# Altium project EmitterPCB.PrjPcb
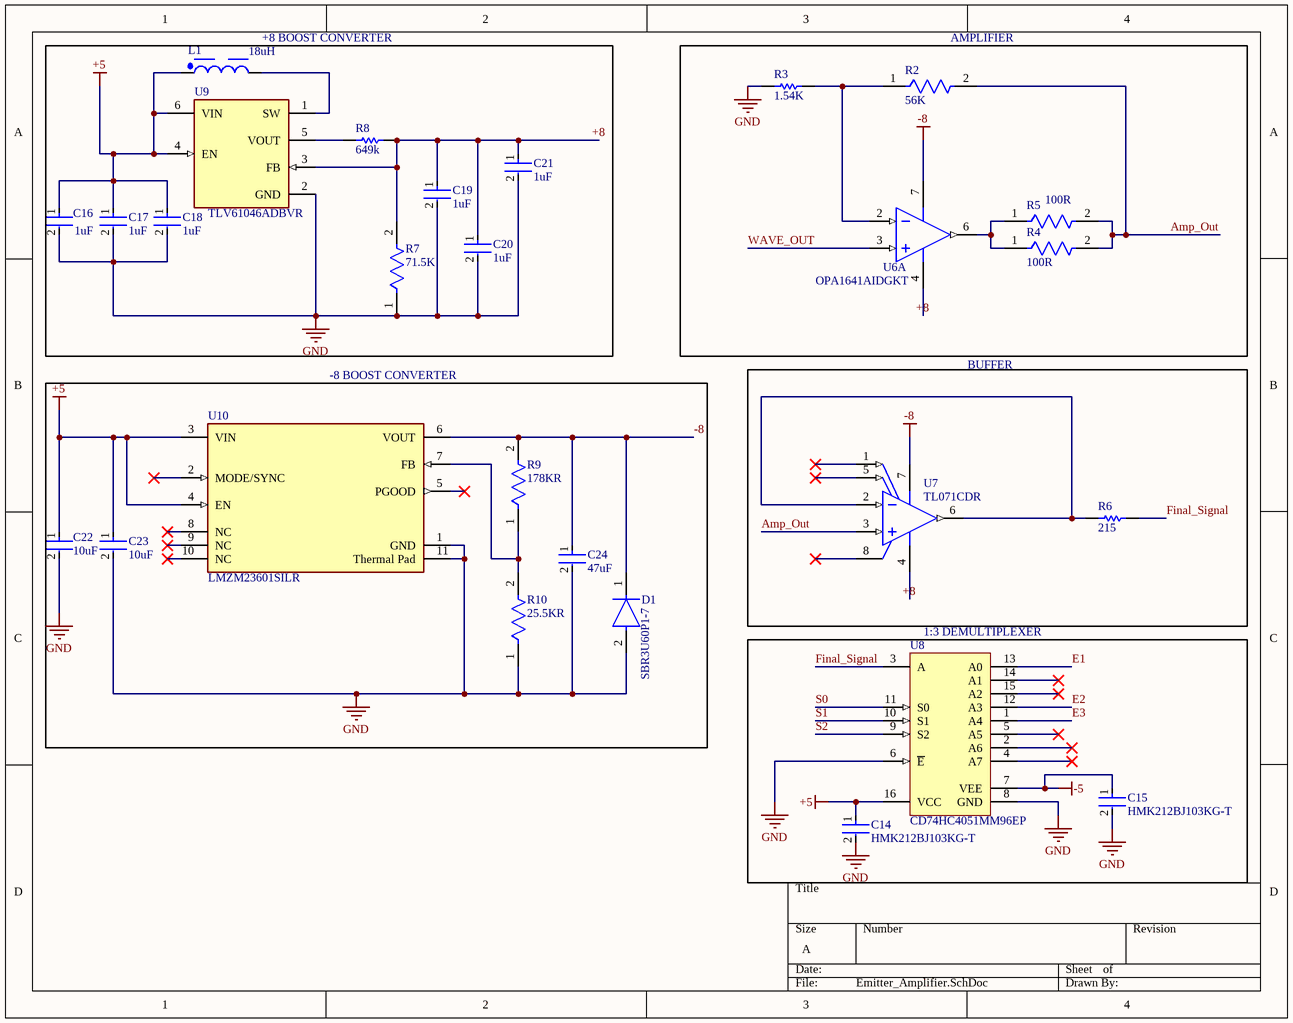
[diagram p0: Emitter_Amplifier.SchDoc]
2 sheets, 34 parts. Net scope: global (net labels, ports and power ports of the same name join across sheets).
Board file: EmitterPCB.PcbDoc
Sheets:
  Emitter_Amplifier.SchDoc
  -5BuckConverter.SchDoc

## Sheet Emitter_Amplifier.SchDoc
size A; SheetNumber: 2; SheetTotal: 3

### Parts
C14  HMK212BJ103KG-T  [FP-0805-L_2_0_0_1-W_1_25-IPC_B]
C15  HMK212BJ103KG-T  [FP-0805-L_2_0_0_1-W_1_25-IPC_B]
C16  1uF  [FP-0603-L_1_6_0_1-W_0_8_0-IPC_C]
C17  1uF  [FP-0603-L_1_6_0_1-W_0_8_0-IPC_C]
C18  1uF  [FP-0603-L_1_6_0_1-W_0_8_0-IPC_C]
C19  1uF  [FP-0603-L_1_6_0_1-W_0_8_0-IPC_C]
C20  1uF  [FP-0603-L_1_6_0_1-W_0_8_0-IPC_C]
C21  1uF  [FP-0603-L_1_6_0_1-W_0_8_0-IPC_C]
C22  10uF  [FP-GRM21B-0_15-IPC_A]
C23  10uF  [FP-0805-L_2_0_0_2-W_1_25-IPC_A]
C24  47uF  [FP-GRM32E-0_3-0_2-IPC_C]
D1  SBR3U60P1-7  [FP-PowerDI123-MFG]
L1  18uH  [WE-PD2_5848]
R2  56K  [FP-MCR10-IPC_C]
R3  1.54K  [RESC2013X70X40LL20T20]
R4  100R  [FP-ERJ6EN-MFG]
R5  100R  [FP-ERJ6EN-MFG]
R6  215  [RESC2013X70X40NL20T20]
R7  71.5K  [FP-RG2012-MFG]
R8  649k  [RESC2013X70X40ML20T20]
R9  178KR  [FP-CR0805-IPC_C]
R10  25.5KR  [FP-CRCW0805-e3-IPC_A]
U6  OPA1641AIDGKT  [DGK0008A_N]  (part A of 2)
U7  TL071CDR  [D0008A_M]
U8  CD74HC4051MM96EP  [D0016A_L]
U9  TLV61046ADBVR  [FP-DBV0006A-MFG]
U10  LMZM23601SILR  [FP-SIL0010A-MFG]

### Blocks framed on the sheet
+8 BOOST CONVERTER: C16-C21 L1 R7 R8 U9
AMPLIFIER: R2-R5 U6
-8 BOOST CONVERTER: C22-C24 D1 R9 R10 U10
BUFFER: R6 U7
1:3 DEMULTIPLEXER: C14 C15 U8

### Nets
+5: C14.1 C16.1 C17.1 C18.1 C22.1 C23.1 L1.1 U8.16(VCC) U9.4(EN) U9.6(VIN) U10.3(VIN) U10.4(EN)
-5: C15.1 U8.7(VEE)
-8: C24.1 D1.1(C) R9.2 U6.7(V+) U7.7(VCC+) U10.6(VOUT)
GND: C14.2 C15.2 C16.2 C17.2 C18.2 C19.2 C20.2 C21.2 C22.2 C23.2 C24.2 D1.2(A) R3.1 R7.1 R10.1 U8.6(~{E}) U8.8(GND) U9.2(GND) U10.1(GND) U10.11(Thermal_Pad)
+8: C19.1 C20.1 C21.1 R7.2 R8.1 U6.4(V-) U7.4(VCC-) U9.3(FB)
Amp_Out: R2.2 R4.2 R5.2 U7.3(IN+)
E1: U8.13(A0)
E2: U8.12(A3)
E3: U8.1(A4)
Final_Signal: R6.2 U8.3(A)
S0: U8.11(S0)
S1: U8.10(S1)
S2: U8.9(S2)
WAVE_OUT: U6.3(IN+)
NetL1_2: L1.2 U9.1(SW)
NetR2_1: R2.1 R3.2 U6.2(IN-)
NetR4_1: R4.1 R5.1 U6.6(OUT)
NetR6_1: R6.1 U7.2(IN-) U7.6(OUT)
NetR8_2: R8.2 U9.5(VOUT)
NetR9_1: R9.1 R10.2 U10.7(FB)

Not connected (* = marked no-connect by the designer): U7 1(OFFSET_N1)* 5(OFFSET_N2)* 8(NC)*; U8 2(A6)* 4(A7)* 5(A5)* 14(A1)* 15(A2)*; U10 2(MODE/SYNC)* 5(PGOOD)* 8(NC)* 9(NC)* 10(NC)*

### Library data of the parts
C14 C15 = CMP-14477-005128-2: Multilayer Ceramic Capacitor 0.01 uF 100V B 10% SMD 0805 T/R; Capacitance: 10nF; Dielectric: X5R; Depth: 1.25mm; Width: 1.25mm; Voltage: 100V; Mount: Surface Mount; Min Operating Temperature: -55°C; Voltage Rating (DC): 100V; Tolerance: 10%; Height: 1.25mm; Radiation Hardening: No; Lead Free: Lead Free; Max Operating Temperature: 85°C; Length: 2mm; Halogen Free: Halogen Free; Case/Package: Ceramic; Packaging: Tape and Reel; RoHS Compliant: Yes
C16-C21 = CMP-14477-000018-3: None; Voltage Rating (DC): 16V; Dielectric: X7R; Tolerance: 10%; Halogen Free: Halogen Free; Height: 0.8mm; REACH SVHC: No SVHC; Contact Plating: Nickel; Number of Pins: 2; Resistor Type: Ceramic; Series: M; Thickness: 0.035inch; Construction: Flat; Voltage Rating: 16V; Capacitance: 1uF; Packaging: Tape and Reel; Width: 0.031inch; Length: 1.6mm; Case Code (Metric): 1608; RoHS Compliant: Yes; Termination: SMD/SMT; Min Operating Temperature: -55°C; Case/Package: 0603; Mount: Surface Mount; Case Code (Imperial): 0603; Depth: 0.8mm; Package Quantity: 1; Max Operating Temperature: 125°C; Lead Free: Lead Free; Radiation Hardening: No
C22 = CMP-06035-013048-1: Chip Multilayer Ceramic Capacitors for General Purpose, 0805, 10uF, X5R, 15%, 20%, 25V; Max Operating Temperature: 85°C; Package Quantity: 3000; Case/Package: 0805; Depth: 1.25mm; Case Code (Imperial): 0805; Termination: SMD/SMT; Width: 0.049inch; Packaging: Tape and Reel; Tolerance: 20%; Height: 1.25mm; Min Operating Temperature: -55°C; Capacitance: 10uF; Weight: 0.000335oz; Voltage Rating (DC): 25V; Dielectric: X5R; Length: 2mm; Thickness: 0.055inch; Voltage Rating: 25V; Resistor Type: Ceramic; Lead Free: Lead Free; Case Code (Metric): 2012; Mount: Surface Mount; REACH SVHC: No SVHC
C23 = CMP-14477-004821-2: Multilayer Ceramic Capacitor 10uF 35V X5R 10% SMD 0805 T/R; RoHS Compliant: Yes; Lead Free: Lead Free; Case/Package: 0805; Max Operating Temperature: 85°C; Capacitance: 10uF; Tolerance: 10%; Case Code (Metric): 2012; Voltage Rating: 35V; Min Operating Temperature: -55°C; Case Code (Imperial): 0805; Mount: Surface Mount; Packaging: Cut Tape
C24 = CMP-2000-06362-2: CAP CER 47UF 16V X5R 1210; Tolerance: 10%; Material: Ceramic; Case Code (Metric): 3225; RoHS Compliant: Yes; Min Operating Temperature: -55°C; Radiation Hardening: No; Voltage: 16V; Package Quantity: 1; Case Code (Imperial): 1210; REACH SVHC: No SVHC; Capacitance: 47uF; Voltage Rating (DC): 16V; Dielectric: X5R; Case/Package: 1210; Length: 3.2mm; Voltage Rating: 16V; Packaging: Cut Tape; Width: 0.098inch; Number of Pins: 2; Lead Free: Lead Free; Height: 2.5mm; Mount: Surface Mount; Termination: SMD/SMT; Max Operating Temperature: 85°C; Thickness: 0.106inch; Depth: 2.5mm
D1 = CMP-12791-000040-1: DIODE SBR 60V 3A POWERDI123; Manufacturer: Diodes Inc.; Automotive Grade: Grade 0; Peak Reverse Current: 100uA; Max Surge Forward Current: 80A; Max Junction Temp: +150°C; Max Repetitive Reverse Voltage: 60V; Mouser Description: Schottky Diodes & Rectifiers SBR Diode,PDI123 Diode,PDI123,3K; Digikey Description: DIODE SBR 60V 3A POWERDI123; Lead Free: Yes; Automotive: Yes; Height: 1mm; Device Class L1: Discrete Semiconductors; Device Class L3: Rectifier Diodes; RoHS: TRUE; Category: Diode; Temperature Range Low: -65°C; Temperature: -65°C to +150°C; Package: PowerDI123; Manufacturer Part Number: SBR3U60P1-7; Device Class L2: Diodes; Octopart: https://octopart.com/sbr3u60p1-7-diodes+inc.-21328922; Footprint Url: https://www.diodes.com/assets/Package-Files/PowerDI123.pdf; ComponentLink2Description: Datasheet; Forward Current: 3A; ComponentLink2URL: https://www.diodes.com/assets/Datasheets/SBR3U60P1.pdf; Temperature Range High: +150°C; Reverse Voltage: 60V
L1 = CMP-0227-00443-2: NexarPartId: 22866898; Self Resonant Frequency: 19MHz; Inductance: 18µH; DC Resistance (DCR): 104mΩ; Current Rating: 1.45A; Inductance Tolerance: 20%; Max Operating Temperature: 125°C; Length: 5.2mm; Min Operating Temperature: -40°C; Width: 5.8mm; Ambient Temperature Range Low: -40°C; Ambient Temperature Range High: 85°C; RoHS: Compliant; Packaging: Digi-Reel®; Height: 4.5mm
R2 = CMP-08839-017707-1: Thick Film Chip Resistor, 0805, 56kΩ, 5%, 200ppm/°C, 0.125W, 150V; Resistance: 56kR; Max Power Dissipation: 125mW; Series: MCR10; Number of Terminations: 2; Package Quantity: 5000; Length: 0.079inch; Tolerance: 5%; Resistor Type: Thick Film; Width: 0.049inch; Packaging: Tape and Reel; Case Code (Metric): 2012; Voltage Rating (DC): 150V; Case/Package: 0805; RoHS Compliant: Yes; Case Code (Imperial): 0805; Lead Free: Lead Free; Features: Automotive AEC-Q200; Temperature Coefficient: 200ppm/°C; Height: 0.024inch
R3 = CMP-2001-04443-1: Manufacturer: Panasonic; Part Number: ERJ-6ENF1541V
R4 R5 = CMP-2001-04374-6: RES SMD 100 OHM 1% 1/8W 0805; Temperature Coefficient: 100ppm/°C; Voltage Rating (DC): 150V; Max Power Dissipation: 125mW; Resistance: 100R; Case Code (Imperial): 0805; Termination: SMD/SMT; Number of Pins: 2; Case Code (Metric): 2012; Resistor Type: Thick Film; Lead Free: Lead Free; Series: ERJ; Size Code: 0805; Min Operating Temperature: -55°C; RoHS Compliant: Yes; Radiation Hardening: No; Technology: THICK FILM; Contact Plating: Tin; Length: 2mm; Resistance Tolerance: 1%; Military Standard: Not; Case/Package: 0805; REACH SVHC: No SVHC; Max Operating Temperature: 155°C; Construction: Rectangular; Packaging: Tape and Reel; Tolerance: 1%; Voltage Rating: 150V; Power Rating: 125mW; Depth: 1.25mm; Width: 1.2mm; Package Quantity: 1; Mount: Surface Mount; Height: 0.6mm; Number of Terminations: 2; Features: Automotive AEC-Q200
R6 = CMP-2001-00039-1: Manufacturer: Panasonic; Part Number: ERJ-6ENF2150V
R7 = CMP-28537-008762-1: Automotive Metal Thin Film Chip Resistor, 0805, 71.5kΩ, 0.5%, 25ppm/°C, 0.125W, 150V; Voltage Rating: 100V; Max Power Dissipation: 125mW; Power Rating: 100mW; Resistance: 71.5kR; Case/Package: 0805; Min Operating Temperature: -55°C; Width: 0.049inch; Height: 0.02inch; Temperature Coefficient: 25ppm/°C; Resistor Type: Thin Film; Voltage Rating (DC): 150V; RoHS Compliant: Yes; Max Operating Temperature: 155°C; Case Code (Imperial): 0805; Lead Free: Lead Free; Case Code (Metric): 2012; Packaging: Tape and Reel; Package Quantity: 5000; Termination: SMD/SMT; Number of Terminations: 2; Length: 0.079inch; Features: Automotive AEC-Q200; Series: RG; Tolerance: 0.5%
R8 = CMP-2001-00265-1: Manufacturer: Panasonic; Part Number: ERJ-6ENF6493V
R9 = CMP-07231-003764-1: Thick Film Chip Resistors 0805 178kΩ 0.125W 1% 100ppm/°C; Voltage Rating: 150V; Power Rating: 125mW; Length: 2mm; Height: 0.5mm; Case Code (Metric): 2012; Mount: Surface Mount; Military Standard: Not; Package Quantity: 5000; Temperature Coefficient: 100ppm/°C; Width: 1.25mm; Thickness: 508um; Case/Package: 0805; Termination: SMD/SMT; Resistance: 178kR; Case Code (Imperial): 0805; Max Operating Temperature: 155°C; Depth: 1.25mm; Min Operating Temperature: -55°C; Radiation Hardening: No; Contact Plating: Tin; Composition: Thick Film; Tolerance: 1%; Packaging: Tape and Reel
R10 = CMP-2001-03724-2: RES Thick Film, 25.5kΩ, 1%, 0.125W, 100ppm/°C, 0805; Max Power Dissipation: 125mW; Voltage Rating: 150V; Number of Pins: 2; Max Operating Temperature: 155°C; Length: 2mm; Number of Terminations: 2; Package Quantity: 10; Resistance: 25.5kR; Composition: Thick Film; Case Code (Imperial): 0805; Tolerance: 1%; Power Rating: 125mW; Width: 1.25mm; Termination: SMD/SMT; Weight: 0.000194oz; Min Operating Temperature: -55°C; Military Standard: Not; Depth: 1.25mm; Temperature Coefficient: 100ppm/°C; Contact Plating: Tin; Case/Package: 0805; Features: Automotive AEC-Q200; Height: 0.45mm; Lead Free: Lead Free; Voltage Rating (DC): 150V; Case Code (Metric): 2012; Packaging: Tape and Reel; Radiation Hardening: No
U6 = CMP-0808-00041-2: Sound-Plus High-Performance, JFET-Input Audio Operational Amplifier, 4.5 to 36 V, -40 to 85 degC, 8-pin SOP (DGK8), Green (RoHS & no Sb/Br); Manufacturer: Texas Instruments; Number of Channels: 1; GBW(Typ)(MHz): 11; Iq per channel(Max)(mA): 2.3; Code_JEDEC: MO-187; ComponentLink1Description: Manufacturer URL; ComponentLink3Description: Package Specification; ComponentLink2URL: http://www.ti.com/general/docs/lit/getliterature.tsp?genericPartNumber=OPA1641&fileType=pdf; ComponentLink1URL: http://www.ti.com/; Eco-Plan: Green (RoHS & no Sb/Br); PartNumber: OPA1641AIDGKT; ComponentLink2Description: Datasheet; PackageDescription: 8-Pin Thin Small Outline, Body 3 x 3 mm, Pitch 0.65 mm; DatasheetVersion: SBOS484B; Mounting Technology: Surface Mount; SubFamily: Audio Operational Amplifier; ComponentLink3URL: http://www.ti.com/litv/pdf/mpds028d; PackageVersion: 4073329/E, 05/2006; PackageReference: DGK0008A
U7 = CMP-0017-00391-2: Low-Noise JFET-Input General-Purpose Operational Amplifier, 7 to 36 V, 0 to 70 degC, 8-pin SOIC (D8), Green (RoHS & no Sb/Br); Manufacturer: Texas Instruments; IIB(Max)(pA): 200; Total Supply Voltage(Min)(+5V is 5, +/-5V is 10): 7; GBW(Typ)(MHz): 3; Slew Rate(Typ)(V/us): 13; Rating: Military; Sub Family: General Purpose Amplifier, High Supply Voltage Amplifier (>=30V); Number of Channels: 1; Vn at 1kHz(Typ)(nV/rtHz): 18; Total Supply Voltage(Max)(+5V is 5, +/-5V is 10): 36; Iq per channel(Max)(mA): 2.5; CMRR(Min)(dB): 70; Vio (25C)(Max)(mV): 10; DatasheetVersion: SLOS080J; Eco-Plan: Green (RoHS & no Sb/Br); ComponentLink2URL: http://www.ti.com/lit/ds/symlink/tl071.pdf; Code_JEDEC: MS-012; PackageDescription: 8-Pin Plastic Small Outline, Body 4.9 x 3.9 mm, Pitch 1.27 mm; PartNumber: TL071CDR; ComponentLink1URL: http://www.ti.com/; ComponentLink2Description: Datasheet; ComponentLink1Description: Manufacturer URL; PackageReference: D0008A; Mounting Technology: Surface Mount; ComponentLink3URL: http://www.ti.com/litv/pdf/msoi002j; ComponentLink3Description: Package Specification; Offset Drift(Typ)(uV/C): 18; PackageVersion: 4040047-3/M, 06/2011
U8 = CMP-1575-00021-4: Enhanced Product High Speed Cmos Logic Analog Multiplexers/Demultiplexers, D0016A, LARGE T&R; Manufacturer: Texas Instruments; Generic Part Number: CD74HC4051-EP; Ron(Max)(Ohms): 130; Bandwidth(Max)(MHz): 180; Rating: HiRel Enhanced Product; Configuration: 1 X 1：8 MUX; Crosstalk: Yes; VCC(Max)(V): 6; Ron(Typ)(Ohms): 45; VCC(Min)(V): 2; PackageReference: D0016A; Operating Temperature Range(C): -55 to 125; Code_JEDEC: MS-012 variation AC; PackageVersion: http://www.ti.com/lit/ml/mpds178g/mpds178g.pdf; DatasheetVersion: SCLS464A
U9 = CMP-04918-000051-1: IC REG BOOST ADJ SOT23-6; Manufacturer: Texas Instruments; Standoff Height: 0mm; Switching Frequency: 1050kHz; Min Supply Voltage: 1.8V; Nominal Supply Current: 110uA; Output Voltage: 3.3-28V; Max Junction Temp: +125°C; Output Type: AdjustableProgrammable; Output Current: 980mA; Number Of Outputs: 1; Max Supply Voltage: 5.5V; Temperature: -40°C to +125°C; RoHS: TRUE; Device Class L1: Integrated Circuits (ICs); ComponentLink2Description: Datasheet; Mouser Description: 28-V Output Voltage Boost Converter with Power Diode and Isolation Switch 6-SOT-23 -40 to 125; Digikey Description: IC REG BOOST ADJ SOT23-6; Temperature Range Low: -40°C; Device Class L3: Voltage Regulators - Switching; Temperature Range High: +125°C; Manufacturer Part Number: TLV61046ADBVR; Device Class L2: Power Management ICs; ComponentLink2URL: http://www.ti.com/lit/ds/symlink/tlv61046a.pdf; Lead Free: Yes; Category: IC; Automotive: No; Height: 1.45mm; Ipc Land Pattern Name: SOT95P280X145-6; Octopart: https://octopart.com/tlv61046adbvr-texas+instruments-81856326; Switching Topology: Boost; Package: DBV0006A
U10 = CMP-04918-000359-1: DC DC CONVERTER 1.2-15V; Min Input Voltage: 4V; Voltage - Output 1: 15V; Max Input Voltage: 36V; Number of Outputs: 1; Max Output Current: 1A; Mount: Surface Mount; Features: UVLO; Min Operating Temperature: -40°C; RoHS Compliant: Yes; Max Operating Temperature: 125°C

## Sheet -5BuckConverter.SchDoc
size A; SheetNumber: 3; SheetTotal: 3
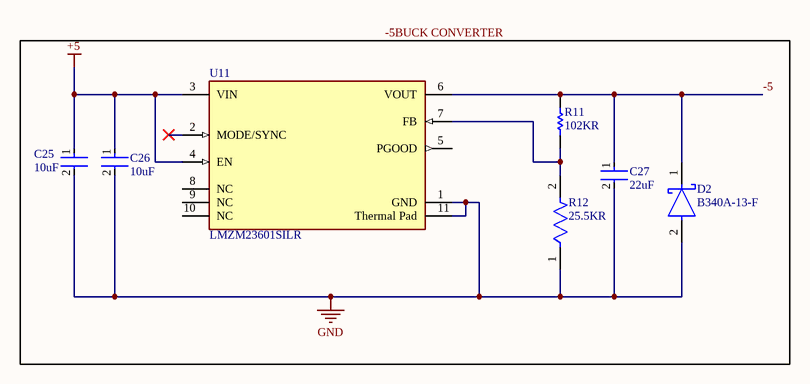
[diagram p1: -5BuckConverter.SchDoc]

### Parts
C25  10uF  [FP-C1608-080-IPC_A]
C26  10uF  [FP-C1608-080-IPC_A]
C27  22uF  [FP-GRM21B-0_2-e0_2_0_7-IPC_C]
D2  B340A-13-F  [FP-SMA-MFG]
R11  102KR  [RESC1005X40X25ML05T05]
R12  25.5KR  [FP-CRCW0402-e3-IPC_A]
U11  LMZM23601SILR  [FP-SIL0010A-MFG]

### Nets
+5: C25.1 C26.1 U11.3(VIN) U11.4(EN)
-5: C27.1 D2.1(C) R11.2 U11.6(VOUT)
GND: C25.2 C26.2 C27.2 D2.2(A) R12.1 U11.1(GND) U11.11(Thermal_Pad)
NetR11_1: R11.1 R12.2 U11.7(FB)

Not connected (* = marked no-connect by the designer): U11 2(MODE/SYNC)* 5(PGOOD) 8(NC) 9(NC) 10(NC)

### Notes on the sheet
- Labels drawn without touching a wire or pin: -5BUCK CONVERTER

### Library data of the parts
C25 C26 = CMP-2000-05442-2: CAP CER 10UF 25V X5R 0603; Dielectric Material: Ceramic; Tolerance: 20%; Dielectric: X5R; Length: 1.6mm; Termination: SMD/SMT; Depth: 0.8mm; RoHS Compliant: Yes; Construction: Flat; Weight: 7.1E-05oz; Thickness: 0.039inch; Packaging: Tape and Reel; Min Operating Temperature: -55°C; Case Code (Imperial): 0603; Case/Package: 0603; Height: 0.8mm; Case Code (Metric): 1608; Voltage Rating: 25V; Resistor Type: Ceramic; Voltage Rating (DC): 25V; Max Operating Temperature: 85°C; REACH SVHC: No SVHC; Lead Free: Lead Free; Series: C; Width: 0.8mm; Mount: Surface Mount; Package Quantity: 1; Capacitance: 10uF
C27 = CMP-06035-039918-1: Chip Multilayer Ceramic Capacitors for General Purpose, 0805, 22uF, X5R, 15%, 20%, 10V; Dissipation Factor: 0.035%; Min Operating Temperature: -55°C; Voltage Rating (DC): 10V; Height: 1.25mm; Depth: 1.25mm; Max Operating Temperature: 85°C; Width: 1.25mm; Lead Free: Lead Free; Dielectric Material: Ceramic; Weight: 0.000335oz; Tolerance: 20%; Voltage Rating: 10V; Case Code (Metric): 2012; Termination: SMD/SMT; Length: 2mm; Thickness: 0.057inch; Case/Package: 0805; Packaging: Tape and Reel; Voltage: 10V; Case Code (Imperial): 0805; Resistor Type: Ceramic; Package Quantity: 3000; Mount: Surface Mount; Capacitance: 22uF; Dielectric: X5R
D2 = CMP-1667-00003-3: DIODE SCHOTTKY 40V 3A SMA; Max Forward Surge Current (Ifsm): 80A; Forward Voltage: 500mV; Polarity: Standard; Max Reverse Current: 500uA; Capacitance: 250pF; Element Configuration: Single; Mount: Surface Mount; Output Current: 3A; Radiation Hardening: No; Width: 2.92mm; Current Rating: 3A; Termination: SMD/SMT; Voltage: 40V; Series: -; Max Operating Temperature: 125°C; Current: 3A; Max Repetitive Reverse Voltage (Vrrm): 40V; Min Operating Temperature: -55°C; REACH SVHC: No SVHC; Number of Pins: 2; Average Rectified Current: 3A; Contact Plating: Tin; RoHS Compliant: Yes; Max Reverse Voltage (DC): 40V; Packaging: Tape and Reel; Height: 2.3mm; Length: 4.6mm; Case/Package: SMA; Weight: 0.002258oz; Peak Non-Repetitive Surge Current: 80A; Package Quantity: 5000; Lead Free: Lead Free; Forward Current: 3A; Voltage Rating (DC): 40V
R11 = CMP-1011-00737-2: Manufacturer: Vishay Dale; Part Number: CRCW0402102KFKED
R12 = CMP-2002-08416-2: RES Thick Film, 25.5kΩ, 1%, 0.063W, 100ppm/°C, 0402; Power Rating: 63mW; Voltage Rating: 50V; Resistance: 25.5kR; Number of Terminations: 2; Length: 1mm; Height: 0.35mm; Termination: SMD/SMT; Radiation Hardening: No; Min Operating Temperature: -55°C; Lead Free: Lead Free; Number of Pins: 2; Mount: Surface Mount; Temperature Coefficient: 100ppm/°C; Weight: 2.3E-05oz; Composition: Thick Film; Depth: 0.5mm; Tolerance: 1%; Width: 0.5mm; Contact Plating: Tin; Features: Automotive AEC-Q200; Max Operating Temperature: 155°C; Case Code (Metric): 1005; Military Standard: Not; Packaging: Tape and Reel; Voltage Rating (DC): 50V; Package Quantity: 10; Case/Package: 0402; Max Power Dissipation: 63mW; Case Code (Imperial): 0402
U11 = CMP-04918-000359-1: as U10 on sheet Emitter_Amplifier; Mount: Surface Mount; Features: UVLO; Min Operating Temperature: -40°C; RoHS Compliant: Yes; Max Operating Temperature: 125°C

## Nets that join several sheets
+5: Emitter_Amplifier (12 pins), -5BuckConverter (C25.1 C26.1 U11.3 U11.4)
-5: Emitter_Amplifier (C15.1 U8.7), -5BuckConverter (C27.1 D2.1 R11.2 U11.6)
GND: Emitter_Amplifier (20 pins), -5BuckConverter (7 pins)